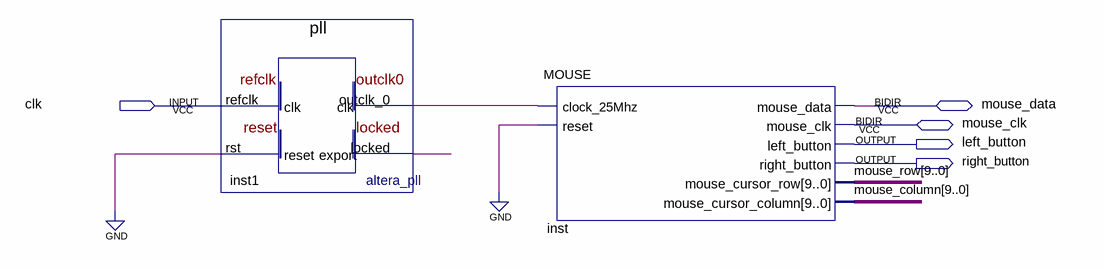
[diagram p0: schematic sheet]
// Quartus schematic Mouse_example.bdf as structural Verilog: 2 symbols, 5 pins
module Mouse_example (
  input  clk,
  inout  mouse_data,
  inout  mouse_clk,
  output left_button,
  output right_button
);

  wire inst1_locked, inst1_outclk_0;
  wire [9:0] mouse_column, mouse_row;

  pll inst1 (.refclk(clk), .rst(1'b0), .outclk_0(inst1_outclk_0), .locked(inst1_locked));
  MOUSE inst (
    .clock_25Mhz(inst1_outclk_0), .reset(1'b0), .left_button(left_button), .right_button(right_button),
    .mouse_cursor_row(mouse_row), .mouse_cursor_column(mouse_column), .mouse_data(mouse_data),
    .mouse_clk(mouse_clk));
endmodule
